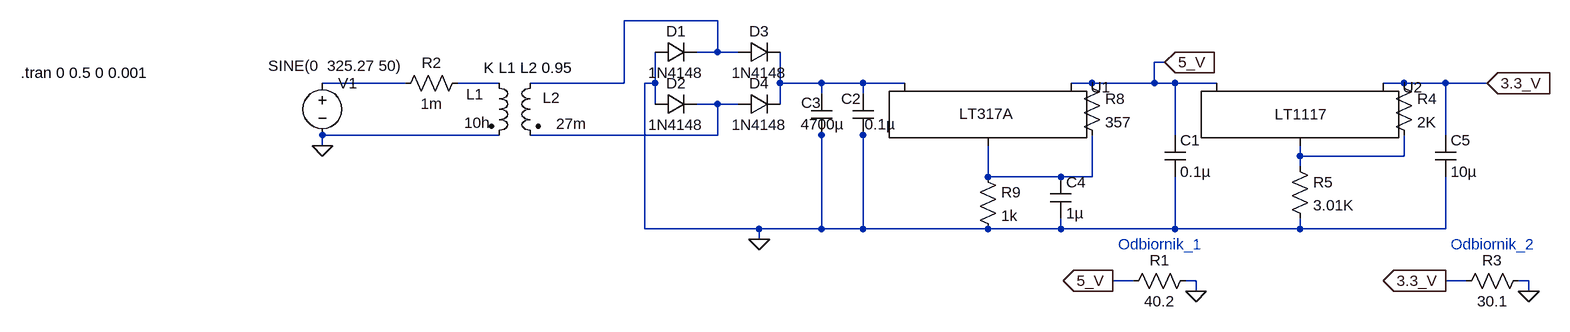
[diagram p0: schematic Power_supply.asc]
Power_supply.asc, the LTspice schematic file:
Version 4.1
SHEET 1 2452 680
WIRE 752 -32 608 -32
WIRE 752 16 752 -32
WIRE 752 16 720 16
WIRE 784 16 752 16
WIRE 1440 32 1424 32
WIRE 272 64 144 64
WIRE 416 64 352 64
WIRE 608 64 608 -32
WIRE 608 64 464 64
WIRE 656 64 656 16
WIRE 656 64 640 64
WIRE 848 64 848 16
WIRE 912 64 848 64
WIRE 976 64 912 64
WIRE 1040 64 976 64
WIRE 1328 64 1296 64
WIRE 1424 64 1424 32
WIRE 1424 64 1328 64
WIRE 1456 64 1424 64
WIRE 1520 64 1456 64
WIRE 1808 64 1776 64
WIRE 1872 64 1808 64
WIRE 1936 64 1872 64
WIRE 912 80 912 64
WIRE 976 80 976 64
WIRE 656 96 656 64
WIRE 752 96 720 96
WIRE 784 96 752 96
WIRE 848 96 848 64
WIRE 416 144 144 144
WIRE 752 144 752 96
WIRE 752 144 464 144
WIRE 912 144 912 128
WIRE 976 144 976 128
WIRE 1456 144 1456 64
WIRE 1872 144 1872 64
WIRE 144 160 144 144
WIRE 1648 176 1648 160
WIRE 1808 176 1808 144
WIRE 1808 176 1648 176
WIRE 1648 192 1648 176
WIRE 1168 208 1168 160
WIRE 1280 208 1168 208
WIRE 1328 208 1328 144
WIRE 1328 208 1280 208
WIRE 640 288 640 64
WIRE 816 288 640 288
WIRE 912 288 912 144
WIRE 912 288 816 288
WIRE 976 288 976 144
WIRE 976 288 912 288
WIRE 1168 288 976 288
WIRE 1280 288 1280 272
WIRE 1280 288 1168 288
WIRE 1456 288 1456 208
WIRE 1456 288 1280 288
WIRE 1648 288 1648 272
WIRE 1648 288 1456 288
WIRE 1872 288 1872 208
WIRE 1872 288 1648 288
WIRE 816 304 816 288
WIRE 1392 368 1360 368
WIRE 1488 368 1472 368
WIRE 1904 368 1872 368
WIRE 2000 368 1984 368
WIRE 1488 384 1488 368
WIRE 2000 384 2000 368
FLAG 144 160 0
FLAG 816 304 0
FLAG 1440 32 5_V
IOPIN 1440 32 In
FLAG 1360 368 5_V
IOPIN 1360 368 Out
FLAG 1488 384 0
FLAG 1872 368 3.3_V
IOPIN 1872 368 Out
FLAG 2000 384 0
FLAG 1936 64 3.3_V
IOPIN 1936 64 In
SYMBOL voltage 144 48 R0
WINDOW 3 -83 -11 Left 2
WINDOW 123 0 0 Left 0
WINDOW 39 0 0 Left 0
SYMATTR Value SINE(0  325.27 50)
SYMATTR InstName V1
SYMBOL ind2 400 48 R0
WINDOW 0 -35 33 Left 2
WINDOW 3 -38 77 Left 2
SYMATTR InstName L1
SYMATTR Value 10h
SYMATTR Type ind
SYMBOL ind2 480 48 M0
WINDOW 0 -30 38 Left 2
WINDOW 3 -71 78 Left 2
SYMATTR InstName L2
SYMATTR Value 27m
SYMATTR Type ind
SYMBOL res 368 48 R90
WINDOW 0 0 56 VBottom 2
WINDOW 3 32 56 VTop 2
SYMATTR InstName R2
SYMATTR Value 1m
SYMBOL diode 656 32 R270
WINDOW 0 32 32 VTop 2
WINDOW 3 0 32 VBottom 2
SYMATTR InstName D1
SYMATTR Value 1N4148
SYMBOL diode 656 112 R270
WINDOW 0 32 32 VTop 2
WINDOW 3 0 32 VBottom 2
SYMATTR InstName D2
SYMATTR Value 1N4148
SYMBOL diode 784 32 R270
WINDOW 0 32 32 VTop 2
WINDOW 3 0 32 VBottom 2
SYMATTR InstName D3
SYMATTR Value 1N4148
SYMBOL diode 784 112 R270
WINDOW 0 32 32 VTop 2
WINDOW 3 0 32 VBottom 2
SYMATTR InstName D4
SYMATTR Value 1N4148
SYMBOL res 1376 384 R270
WINDOW 0 32 56 VTop 2
WINDOW 3 0 56 VBottom 2
SYMATTR InstName R1
SYMATTR Value 40.2
SYMATTR SpiceLine tol=1 pwr=0.1
SYMBOL cap 960 80 R0
WINDOW 0 -18 8 Left 2
WINDOW 3 18 47 Left 2
SYMATTR InstName C2
SYMATTR Value 0.1µ
SYMATTR SpiceLine V=25 Irms=0 Rser=0.037 Lser=674p mfg="Würth Elektronik" pn="885012210008 WCAP-CSGP 1812" type="X7R"
SYMBOL PowerProducts\\LT317A 1168 64 R0
WINDOW 3 -44 47 Left 2
SYMATTR InstName U1
SYMBOL cap 896 80 R0
WINDOW 0 -15 14 Left 2
WINDOW 3 -16 47 Left 2
SYMATTR InstName C3
SYMATTR Value 4700µ
SYMATTR SpiceLine V=6.3 Irms=1.73 Rser=0.034 Lser=0 mfg="Panasonic" pn="ECA0JFQ472" type="Al electrolytic"
SYMBOL cap 1264 208 R0
SYMATTR InstName C4
SYMATTR Value 1µ
SYMATTR SpiceLine V=10 Irms=0 Rser=0.0078 Lser=250p mfg="Würth Elektronik" pn="885012207022 WCAP-CSGP 0805" type="X7R"
SYMBOL res 1312 48 R0
SYMATTR InstName R8
SYMATTR Value 357
SYMATTR SpiceLine tol=1 pwr=0.1
SYMBOL res 1152 192 R0
SYMATTR InstName R9
SYMATTR Value 1k
SYMBOL PowerProducts\\LT1117 1648 64 R0
WINDOW 3 -39 48 Left 2
SYMATTR InstName U2
SYMBOL cap 1440 144 R0
SYMATTR InstName C1
SYMATTR Value 0.1µ
SYMATTR SpiceLine V=6.3 Irms=0 Rser=0 Lser=0 mfg="Murata" pn="GRM033R60J123KE01" type="X5R"
SYMBOL cap 1856 144 R0
SYMATTR InstName C5
SYMATTR Value 10µ
SYMATTR SpiceLine V=4 Irms=0 Rser=0 Lser=0 mfg="Murata" pn="GRM185R60G106ME15" type="X5R"
SYMBOL res 2000 352 R90
WINDOW 0 0 56 VBottom 2
WINDOW 3 32 56 VTop 2
SYMATTR InstName R3
SYMATTR Value 30.1
SYMATTR SpiceLine tol=1 pwr=0.1
SYMBOL res 1792 48 R0
SYMATTR InstName R4
SYMATTR Value 2K
SYMBOL res 1632 176 R0
SYMATTR InstName R5
SYMATTR Value 3.01K
SYMATTR SpiceLine tol=1 pwr=0.1
TEXT -320 48 Left 2 !.tran 0 0.5 0 0.001
TEXT 392 40 Left 2 !K L1 L2 0.95
TEXT 1368 312 Left 2 ;Odbiornik_1
TEXT 1880 312 Left 2 ;Odbiornik_2

The netlist it stands for:
* Power_supply.asc
V1 N002 0 SINE(0  325.27 50)
L1 N003 0 10h
L2 N001 N005 27m
R2 N003 N002 1m
D1 0 N001 1N4148
D2 0 N005 1N4148
D3 N001 N004 1N4148
D4 N005 N004 1N4148
R1 5_V 0 40.2 tol=1 pwr=0.1
C2 N004 0 0.1µ V=25 Irms=0 Rser=0.037 Lser=674p mfg="Würth Elektronik" pn="885012210008 WCAP-CSGP 1812" type="X7R"
X§U1 N007 5_V N004 LT317A
C3 N004 0 4700µ V=6.3 Irms=1.73 Rser=0.034 Lser=0 mfg="Panasonic" pn="ECA0JFQ472" type="Al electrolytic"
C4 N007 0 1µ V=10 Irms=0 Rser=0.0078 Lser=250p mfg="Würth Elektronik" pn="885012207022 WCAP-CSGP 0805" type="X7R"
R8 5_V N007 357 tol=1 pwr=0.1
R9 N007 0 1k
X§U2 N006 3.3_V 5_V LT1117
C1 5_V 0 0.1µ V=6.3 Irms=0 Rser=0 Lser=0 mfg="Murata" pn="GRM033R60J123KE01" type="X5R"
C5 3.3_V 0 10µ V=4 Irms=0 Rser=0 Lser=0 mfg="Murata" pn="GRM185R60G106ME15" type="X5R"
R3 0 3.3_V 30.1 tol=1 pwr=0.1
R4 3.3_V N006 2K
R5 N006 0 3.01K tol=1 pwr=0.1
.model D D
.lib standard.dio
.tran 0 0.5 0 0.001
K L1 L2 0.95
* Odbiornik_1
* Odbiornik_2
.lib LTC.lib
.lib LT1117.lib
.backanno
.end